# EAGLE schematic Finger Password Keyboard (EAGLE 7.2.0)
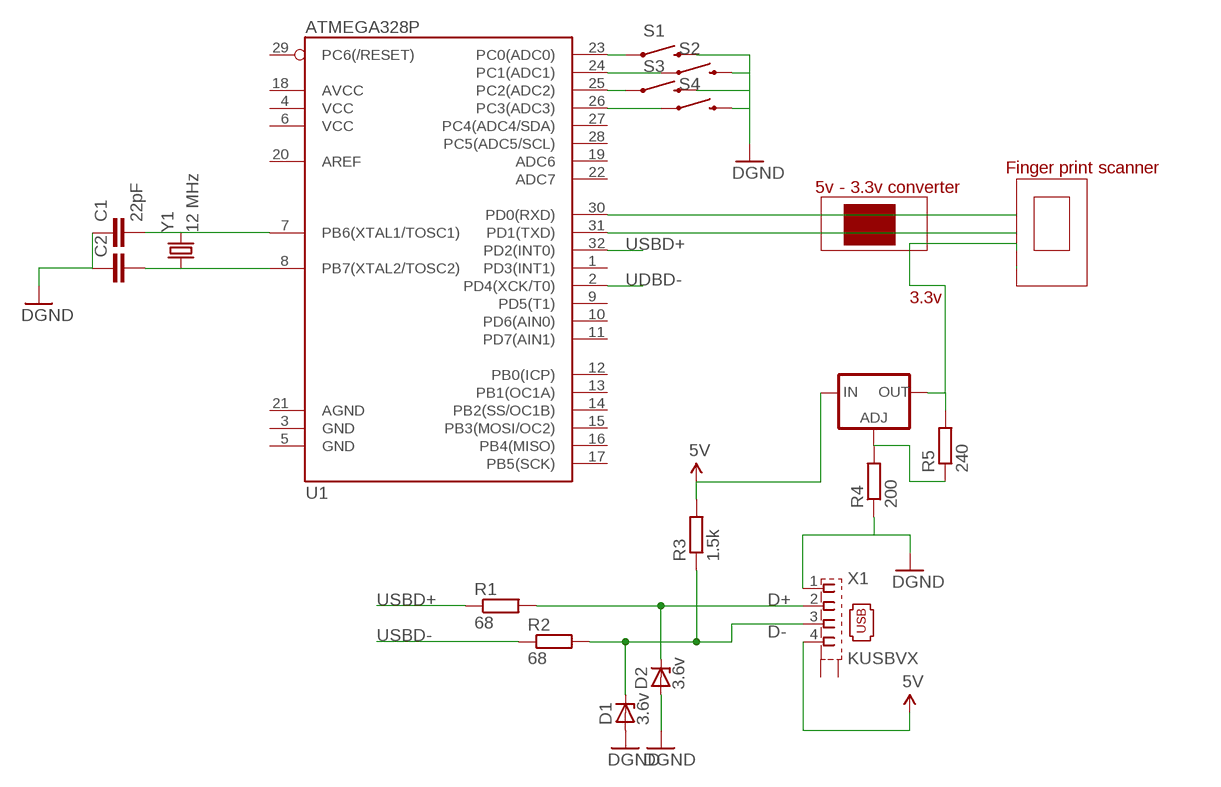
[diagram p0: schematic, sheet 1]

## Parts
C1  22pF  CAP0402-CAP  [0402-CAP]
C2  CAP0402-CAP  [0402-CAP]
D1  3.6v  ZENER-DIODEC1702-15  [C1702-15]
D2  3.6v  ZENER-DIODEC1702-15  [C1702-15]
R1  68  R-EU_0204/7  [0204/7]
R2  68  R-EU_0204/7  [0204/7]
R3  1.5k  R-EU_0204/7  [0204/7]
R4  200  R-EU_0204/2V  [0204V]
R5  240  R-EU_0204/2V  [0204V]
S1  SWITCH-MOMENTARY-2PTH  [TACTILE-PTH]
S2  SWITCH-MOMENTARY-2PTH  [TACTILE-PTH]
S3  SWITCH-MOMENTARY-2PTH  [TACTILE-PTH]
S4  SWITCH-MOMENTARY-2PTH  [TACTILE-PTH]
U1  ATMEGA328P  ATMEGA328_SMT  [TQFP32-08]
U2  V_REG_317SINK  [TO220-ADJ]
X1  KUSBVX  [KUSBVX]
Y1  12 MHz  CRYSTALHC49UV  [HC49U-V]

## Nets
5V: R3.2 U2.IN X1.4
GND: C1.1 C2.1 D1.A D2.A R4.1 S1.3 S2.3 S3.3 S4.3 X1.1 ; supply symbol labelled DGND
N$1: C1.2 U1.7(PB6(XTAL1/TOSC1)) Y1.2
N$2: C2.2 U1.8(PB7(XTAL2/TOSC2)) Y1.1
N$3: U1.30(PD0(RXD))
N$4: U1.31(PD1(TXD))
N$5: S1.1 U1.23(PC0(ADC0))
N$6: D1.C R2.2 R3.1 X1.3
N$7: D2.C R1.2 X1.2
N$8: S2.1 U1.24(PC1(ADC1))
N$9: S3.1 U1.25(PC2(ADC2))
N$10: S4.1 U1.26(PC3(ADC3))
N$12: R4.2 R5.1 U2.ADJ
N$13: R5.2 U2.OUT
UDBD-: U1.2(PD4(XCK/T0))
USBD+: R1.1 U1.32(PD2(INT0))
USBD-: R2.1
Unconnected: U1.1(PD3(INT1)) U1.3(GND) U1.4(VCC) U1.5(GND) U1.6(VCC) U1.9(PD5(T1)) U1.10(PD6(AIN0)) U1.11(PD7(AIN1)) U1.12(PB0(ICP)) U1.13(PB1(OC1A)) U1.14(PB2(SS/OC1B)) U1.15(PB3(MOSI/OC2)) U1.16(PB4(MISO)) U1.17(PB5(SCK)) U1.18(AVCC) U1.19(ADC6) U1.20(AREF) U1.21(AGND) U1.22(ADC7) U1.27(PC4(ADC4/SDA)) U1.28(PC5(ADC5/SCL)) U1.29(PC6(/RESET)) X1.M1(S1) X1.M2(S2)

## Notes on the sheet
- Finger print scanner
- 5v - 3.3v converter
- 3.3v
- D+
- D-

## Library data of the parts
C1 C2 = SparkFun-Passives:CAP: Capacitor Standard 0603 ceramic capacitor, and 0.1" leaded capacitor.
D1 D2 = diode:ZENER-DIODE: Z-Diode
R1-R5 = resistor:R-EU_: RESISTOR, European symbol
S1-S4 = SparkFun-Electromechanical:SWITCH-MOMENTARY-2: Various NO switches- pushbuttons, reed, etc
U1 = SparkFun-DigitalIC:ATMEGA328_SMT: 32-Pin Atmega328 part Commonly used on Arduino compatible boards Available in QFP and QFN packages TQFP is IC-09069 QFN is non-stock; PROD_ID: IC-09069
U2 = SparkFun-PowerIC:V_REG_317: Voltage Regulator Standard LM317 adjustable voltage regulator. AOI (Adjust Output Input). Google 'LM317 Calculator' for easy to use app to get the two resistor values needed. 240/720 for 5V output. 240/390 for 3.3V output. Spark Fun Electronics SKU : COM-00527
X1 = con-kycon:KUSBVX: Vertical,Top Entry Universal Serial Bus Connector KUSBVX Series Source: KYCON Sibalco USB vertical socket KUSBV.pdf
Y1 = SparkFun-FreqCtrl:CRYSTAL: Various standard crystals. Proven footprints.